# EasyEDA schematic SCH_PianoBoard_P3_2024-09-13.json
TITLE: PIC PIANO (P3); REV: 1.0; Date: 2024-09-13; Sheet: 1/1; Drawn By: Skynet; Company: Skynet
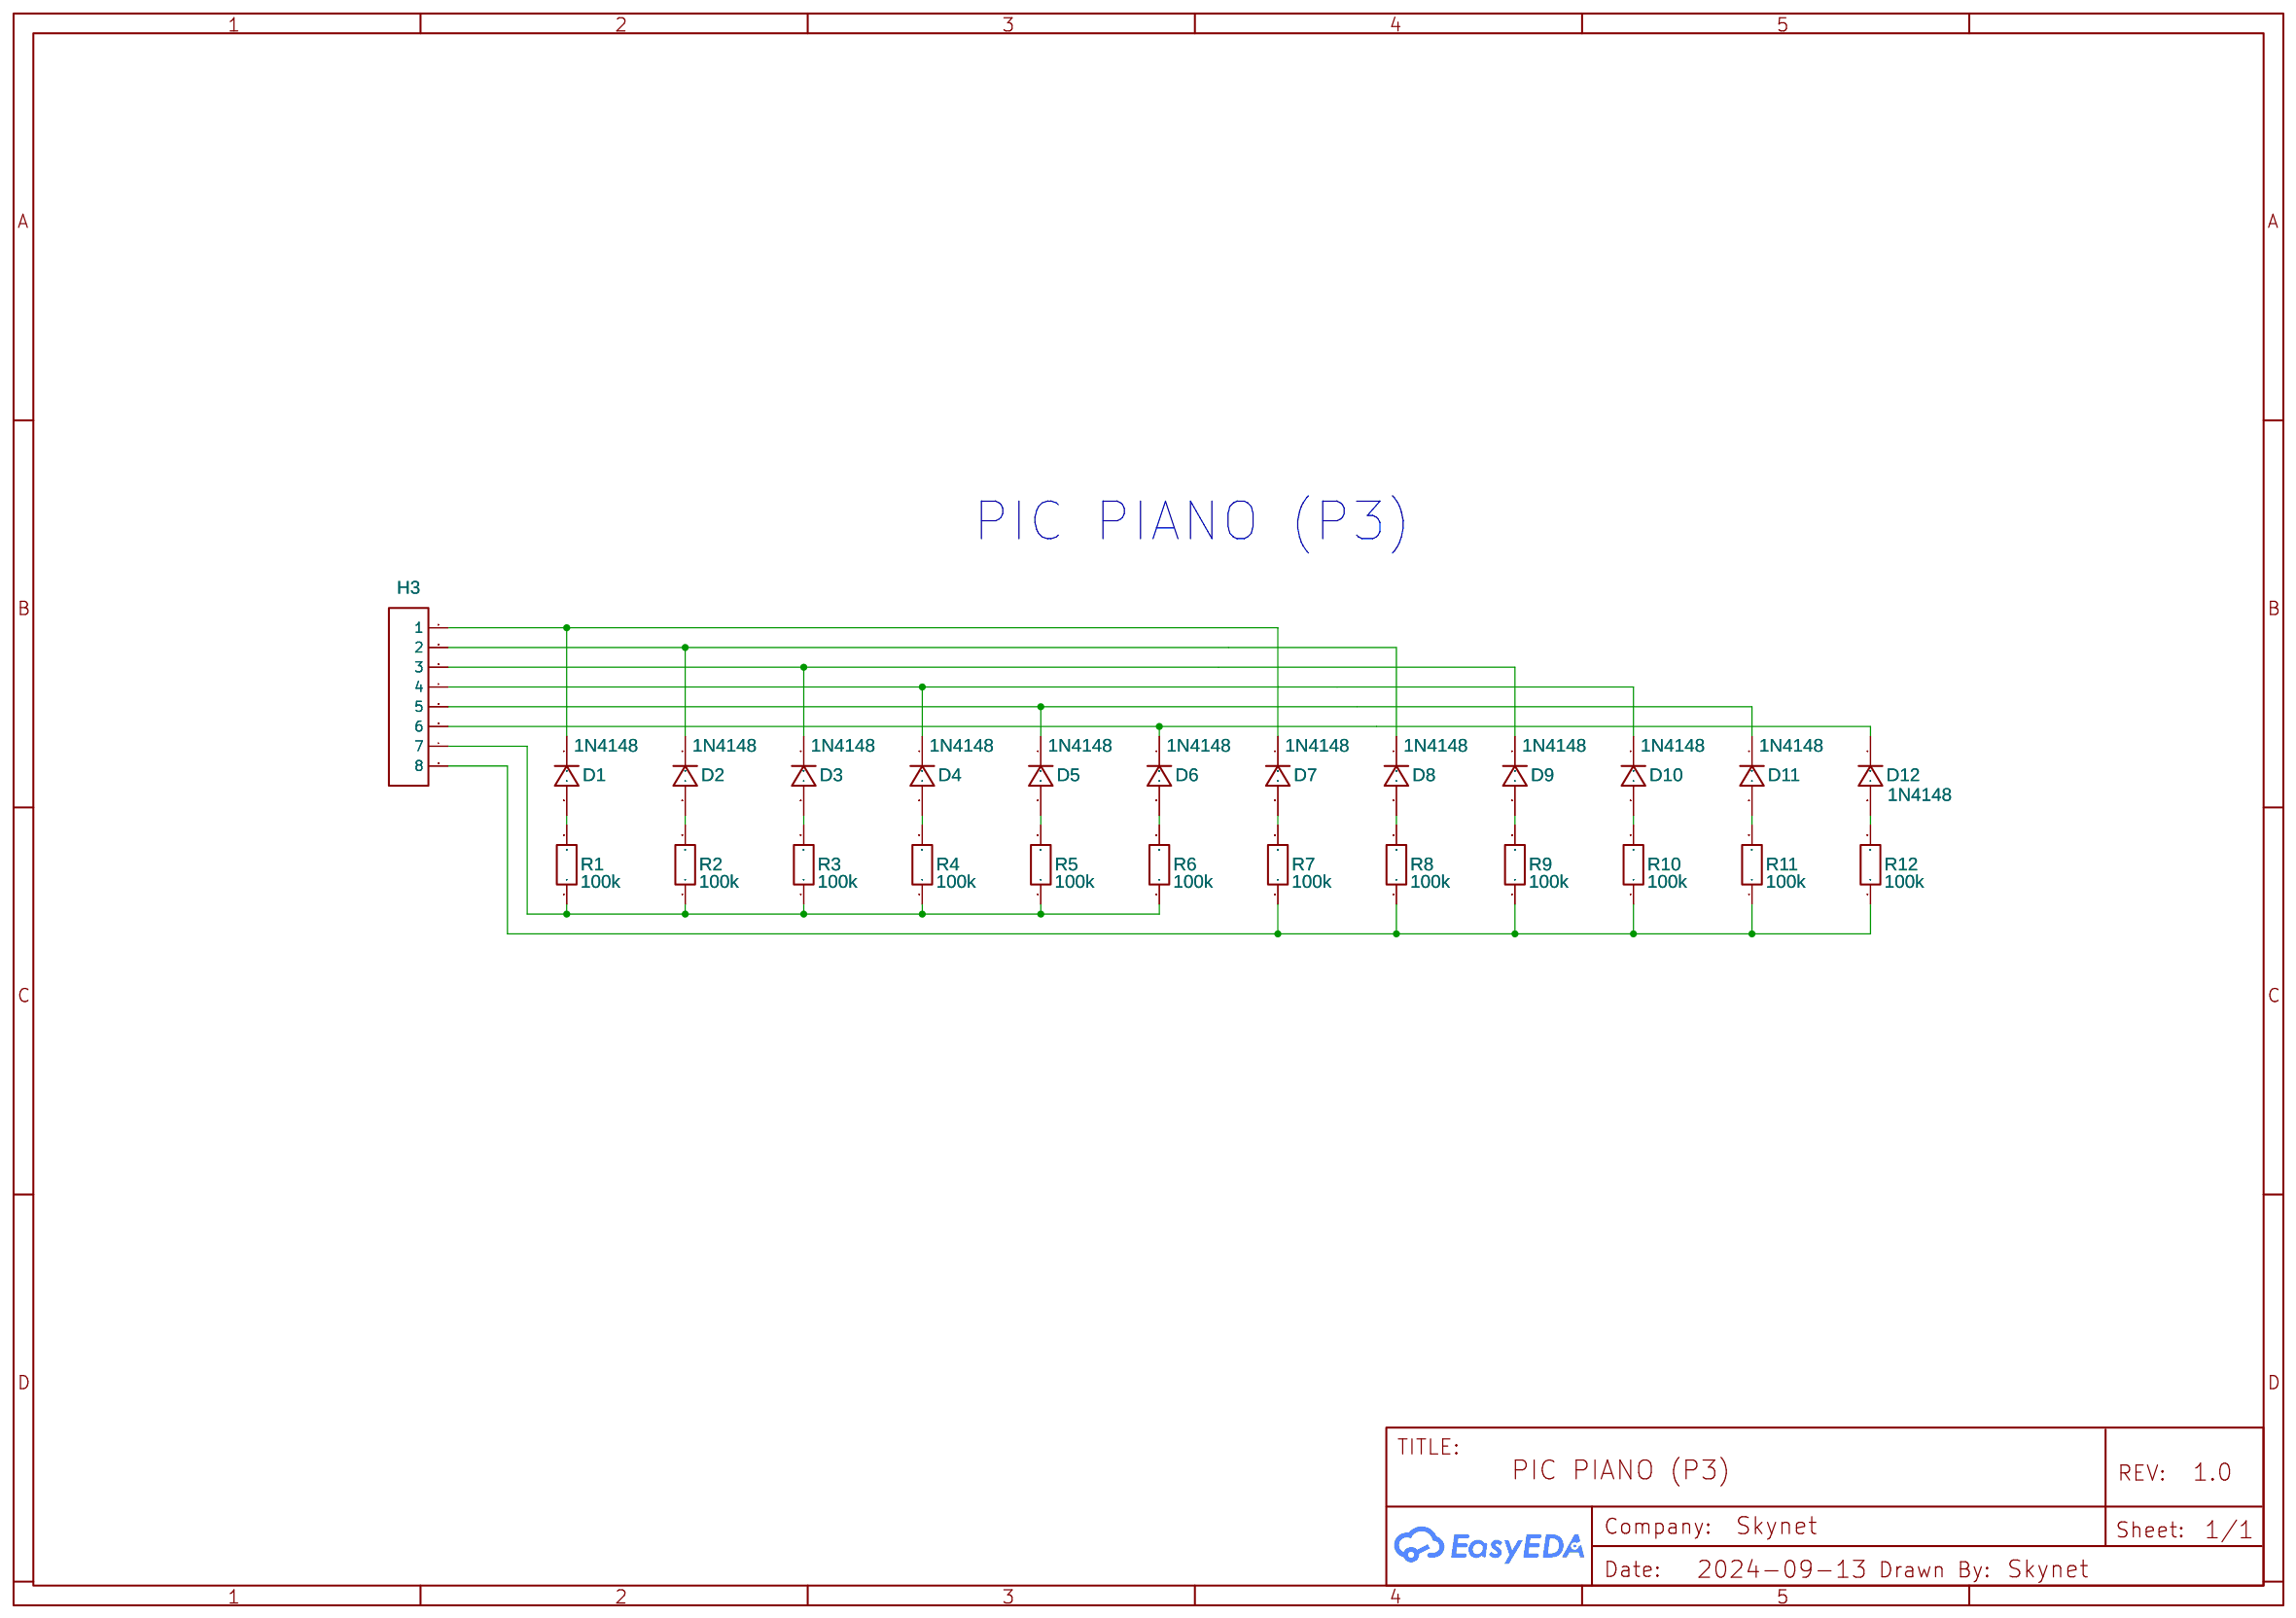
[diagram p0: schematic sheet]

## Parts
D1  1N4148  [SOD-323_L1.8-W1.3-LS2.5-RD]
D2  1N4148  [SOD-323_L1.8-W1.3-LS2.5-RD]
D3  1N4148  [SOD-323_L1.8-W1.3-LS2.5-RD]
D4  1N4148  [SOD-323_L1.8-W1.3-LS2.5-RD]
D5  1N4148  [SOD-323_L1.8-W1.3-LS2.5-RD]
D6  1N4148  [SOD-323_L1.8-W1.3-LS2.5-RD]
D7  1N4148  [SOD-323_L1.8-W1.3-LS2.5-RD]
D8  1N4148  [SOD-323_L1.8-W1.3-LS2.5-RD]
D9  1N4148  [SOD-323_L1.8-W1.3-LS2.5-RD]
D10  1N4148  [SOD-323_L1.8-W1.3-LS2.5-RD]
D11  1N4148  [SOD-323_L1.8-W1.3-LS2.5-RD]
D12  1N4148  [SOD-323_L1.8-W1.3-LS2.5-RD]
H3  HDR-F-2.54_1x8  [HDR-F-2.54_1X8]
R1  100k  [R0603]
R2  100k  [R0603]
R3  100k  [R0603]
R4  100k  [R0603]
R5  100k  [R0603]
R6  100k  [R0603]
R7  100k  [R0603]
R8  100k  [R0603]
R9  100k  [R0603]
R10  100k  [R0603]
R11  100k  [R0603]
R12  100k  [R0603]

## Library data of the parts
D1-D12 = 1N4148WX-TP: Contributor: LCSC; Supplier: LCSC; Supplier Part: C78740; Manufacturer: MCC(美微科); JLCPCB Part Class: Extended Part; link: https://lcsc.com/eda_search?q=C78740&%26type=1&ref=editor
H3 = HDR-F-2.54_1x8: Supplier Part: C225505; Supplier: LCSC; Contributor: LCEDA_Lib
R1-R12 = R_0603_EU: Contributor: LCEDA_Lib

## Nets
Net-(D1-1): D1.1(C) D7.1(C) H3.1
Net-(D1-2): D1.2(A) R1.2
Net-(D2-1): D2.1(C) D8.1(C) H3.2
Net-(D2-2): D2.2(A) R2.2
Net-(D3-1): D3.1(C) D9.1(C) H3.3
Net-(D3-2): D3.2(A) R3.2
Net-(D4-1): D4.1(C) D10.1(C) H3.4
Net-(D4-2): D4.2(A) R4.2
Net-(D5-1): D5.1(C) D11.1(C) H3.5
Net-(D5-2): D5.2(A) R5.2
Net-(D6-1): D6.1(C) D12.1(C) H3.6
Net-(D6-2): D6.2(A) R6.2
Net-(D7-2): D7.2(A) R7.2
Net-(D8-2): D8.2(A) R8.2
Net-(D9-2): D9.2(A) R9.2
Net-(D10-2): D10.2(A) R10.2
Net-(D11-2): D11.2(A) R11.2
Net-(D12-2): D12.2(A) R12.2
Net-(H3-7): H3.7 R1.1 R2.1 R3.1 R4.1 R5.1 R6.1
Net-(H3-8): H3.8 R7.1 R8.1 R9.1 R10.1 R11.1 R12.1

## Notes on the sheet
- PIC PIANO (P3)
